# EAGLE design Domino USB MicroSD Passive Overcurrent Protection (EAGLE 6.5.0)
DATABASE: ./../Common/BOM/Domino_DB.txt; DRAWN: M.STEMPIN; REV: A
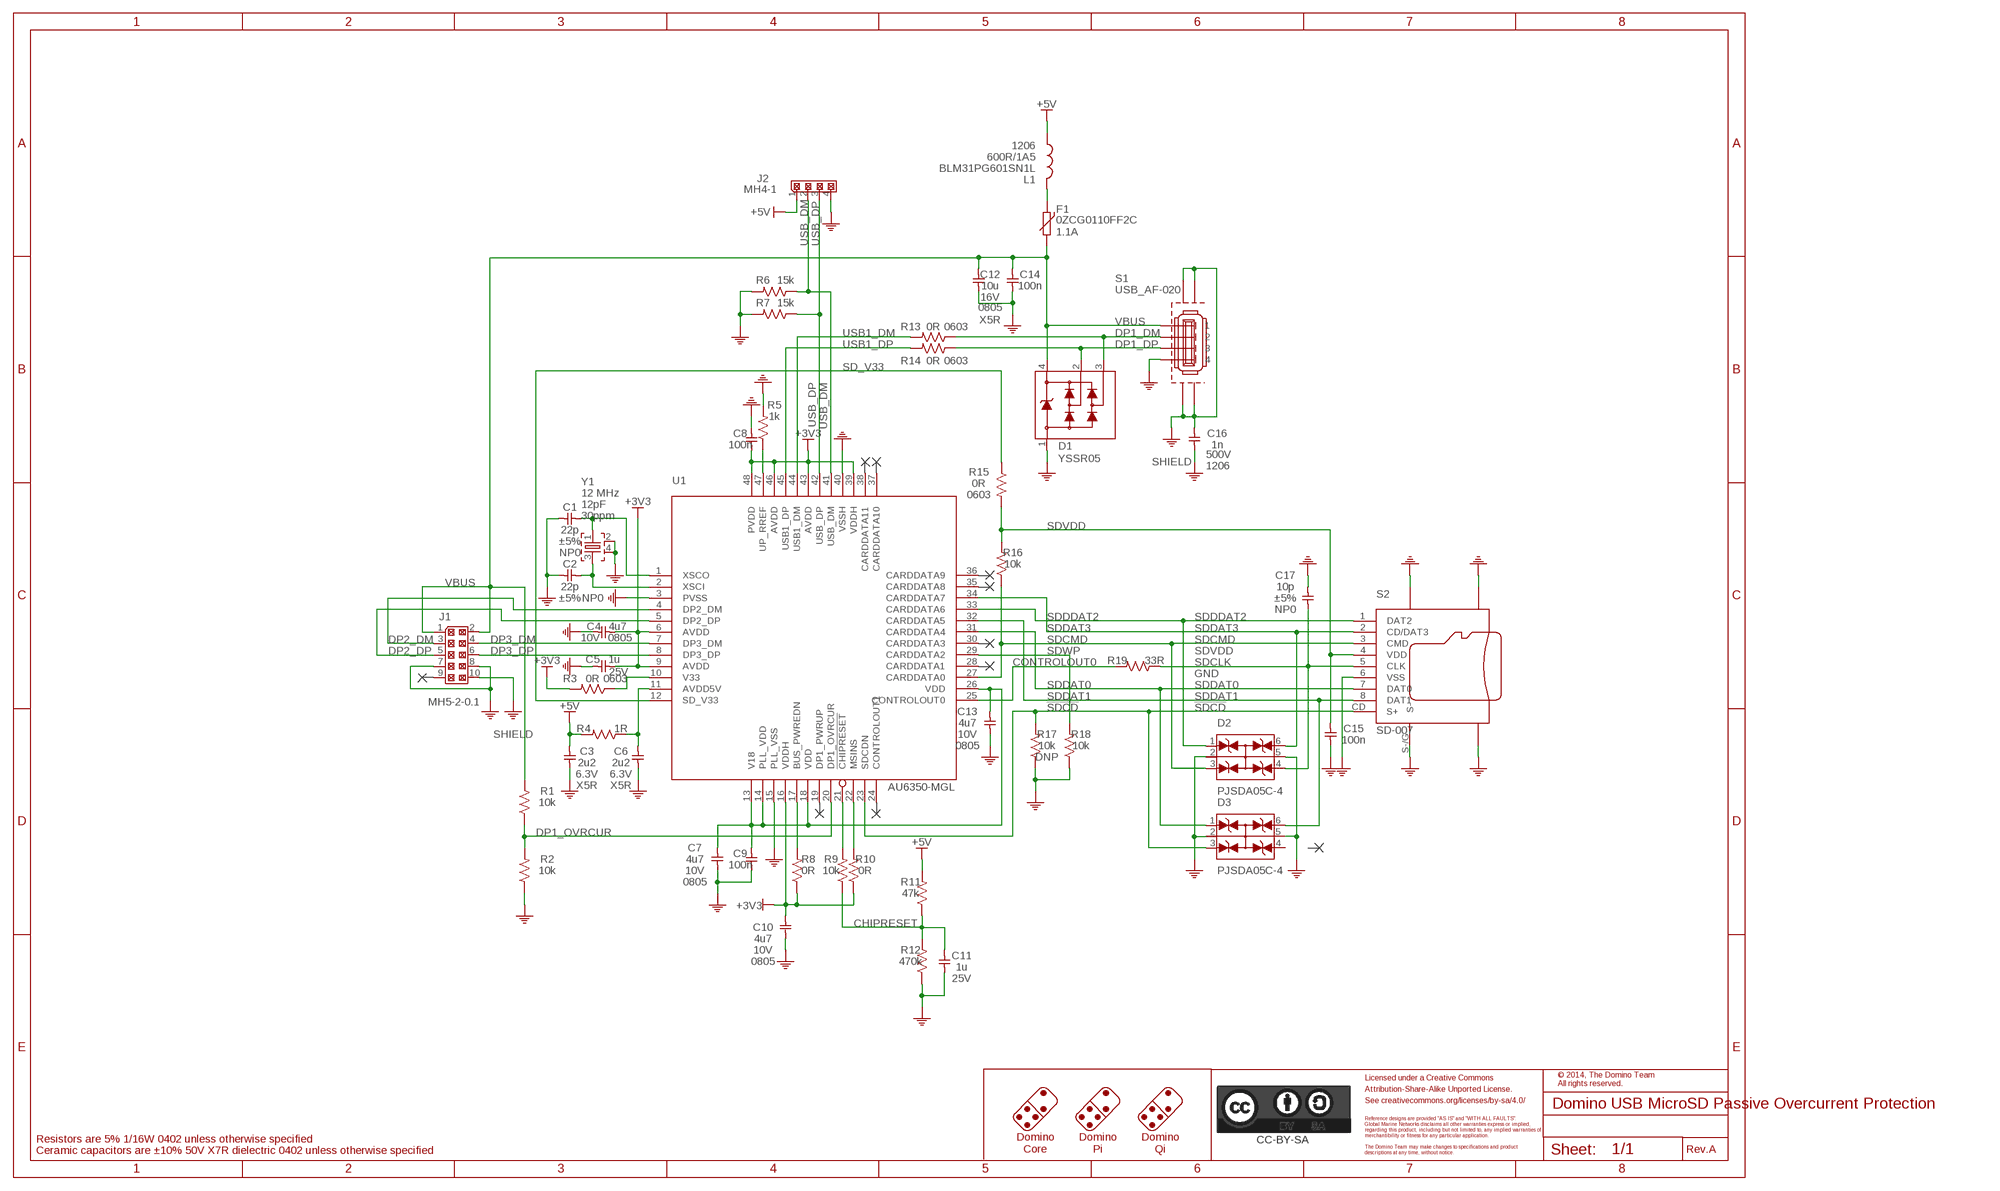
[diagram p0: schematic, sheet 1]
PORT1 (NC): BOM: EXCLUDE
PORT2 (NC): BOM: EXCLUDE
PORT3 (NC): BOM: EXCLUDE
PORT4 (NC): BOM: EXCLUDE
PORT5 (NC): BOM: EXCLUDE
PORT6 (NC): BOM: EXCLUDE
PORT7 (NC): BOM: EXCLUDE
PORT8 (NC): BOM: EXCLUDE
PORT9 (NC): BOM: EXCLUDE
PORT10 (NC): BOM: EXCLUDE

## Parts
C1  22p  CAP_0402  [C0402]
C2  22p  CAP_0402  [C0402]
C3  2u2  CAP_0402  [C0402]
C4  4u7  CAP_0805  [C0805]
C5  1u  CAP_0402  [C0402]
C6  2u2  CAP_0402  [C0402]
C7  4u7  CAP_0805  [C0805]
C8  100n  CAP_0402  [C0402]
C9  100n  CAP_0402  [C0402]
C10  4u7  CAP_0805  [C0805]
C11  1u  CAP_0402  [C0402]
C12  10u  CAP_0805  [C0805]
C13  4u7  CAP_0805  [C0805]
C14  100n  CAP_0402  [C0402]
C15  100n  CAP_0402  [C0402]
C16  1n  CAP_1206  [C1206]
C17  10p  CAP_0402  [C0402]
CC-BY-SA1  CC-BY-SA_LOGO  [CC-BY-SA_LOGO]
D1  YSSR05  [SOT143B]
D2  PJSDA05C-4  [SOT23-6]
D3  PJSDA05C-4  [SOT23-6]
F1  0ZCG0110FF2C  [PTC1812]
J1  MH5-2-0.1  MH5-2  [MH05-2-0.1]
J2  MH4-1  [MH4-1-0.1]
L1  BLM31PG601SN1L  FB_1206  [FB1206]
R1  10k  RES_0402  [R0402]
R2  10k  RES_0402  [R0402]
R3  0R  RES_0603  [R0603]
R4  1R  RES_0402  [R0402]
R5  1k  RES_0402  [R0402]
R6  15k  RES_0402  [R0402]
R7  15k  RES_0402  [R0402]
R8  0R  RES_0402  [R0402]
R9  10k  RES_0402  [R0402]
R10  0R  RES_0402  [R0402]
R11  47k  RES_0402  [R0402]
R12  470k  RES_0402  [R0402]
R13  0R  RES_0603  [R0603]
R14  0R  RES_0603  [R0603]
R15  0R  RES_0603  [R0603]
R16  10k  RES_0402  [R0402]
R17  10k  RES_0402  [R0402]
R18  10k  RES_0402  [R0402]
R19  33R  RES_0402  [R0402]
S1  USB_AF-020  [USB_AF-020]
S2  SD-007  MICRO-SD  [SD-007]
U1  AU6350-MGL  [LQFP-48_7X7]
Y1  12 MHz  CRYSTAL_2SH  [CRYSTAL_32X25]

## Nets
!CHIPRESET: R9.2 U1.21(!CHIPRESET)
!SDCD: D3.3 R17.2 S2.CD(S+) U1.23(SDCDN)
+3V3: C4.2 C5.2 C8.2 C10.2 R3.2 R8.1 R10.1 U1.6(AVDD) U1.9(AVDD) U1.16(VDDH) U1.39(VDDH) U1.43(AVDD) U1.46(AVDD) U1.48(PVDD)
+5V: C3.1 J2.1 L1.2 R4.2 R11.2
BUS_PWREDN: R8.2 U1.17(BUS_PWREDN)
CHIPRESET: C11.1 R9.1 R11.1 R12.2
CONTROLOUT0: R19.2 U1.25(CONTROLOUT0)
DP1_DM: D1.3 R13.1 S1.2
DP1_DP: D1.2 R14.1 S1.3
DP1_OVRCUR: R1.1 R2.2 U1.20(DP1_OVRCUR)
DP2_DM: J1.3 U1.4(DP2_DM)
DP2_DP: J1.5 U1.5(DP2_DP)
DP3_DM: J1.4 U1.7(DP3_DM)
DP3_DP: J1.6 U1.8(DP3_DP)
GND: C1.1 C2.1 C3.2 C4.1 C5.1 C6.2 C7.1 C8.1 C9.2 C10.1 C11.2 C12.2 C13.1 C14.2 C15.2 C16.2 C17.2 D1.1 D2.2 D2.5 D3.2 D3.5 J1.7 J1.8 J2.4 R2.1 R5.2 R6.2 R7.2 R12.1 R17.1 R18.1 S1.4 S2.6(VSS) S2.G$1(G) S2.G$2(G) S2.G$3(G) S2.S-/G(S-) U1.3(PVSS) U1.15(PLL_VSS) U1.40(VSSH) Y1.2 Y1.4
MSINS: R10.2 U1.22(MSINS)
N$2: F1.1 L1.1
N$3: C6.1 R4.1 U1.11(AVDD5V)
N$4: R3.1 U1.10(V33)
SD_V33: R15.1 U1.12(SD_V33)
SDCLK: C17.1 D2.4 R19.1 S2.5(CLK)
SDCMD: D2.3 R16.1 S2.3(CMD) U1.27(CARDDATA0)
SDDAT0: D3.1 S2.7(DAT0) U1.31(CARDDATA4)
SDDAT1: D3.6 S2.8(DAT1) U1.32(CARDDATA5)
SDDAT3: D2.6 S2.2(CD/DAT3) U1.34(CARDDATA7)
SDDDAT2: D2.1 S2.1(DAT2) U1.33(CARDDATA6)
SDVDD: C15.1 R15.2 R16.2 S2.4(VDD)
SDWP: R18.2 U1.29(CARDDATA2)
SHIELD: C16.1 J1.10 S1.G$1(G) S1.G$2(G) S1.G$3(G) S1.G$4(G)
UP_PREF: R5.1 U1.47(UP_RREF)
USB1_DM: R13.2 U1.44(USB1_DM)
USB1_DP: R14.2 U1.45(USB1_DP)
USB_DM: J2.2 R6.1 U1.41(USB_DM)
USB_DP: J2.3 R7.1 U1.42(USB_DP)
V18: C7.2 C9.1 C13.2 U1.13(V18) U1.14(PLL_VDD) U1.18(VDD) U1.26(VDD)
VBUS: C12.1 C14.1 D1.4 F1.2 J1.1 J1.2 R1.2 S1.1
XSCI: C2.2 U1.2(XSCI) Y1.3
XSCO: C1.2 U1.1(XSCO) Y1.1
Unconnected: D3.4 J1.9 U1.19(DP1_PWRUP) U1.24(CONTROLOUT1) U1.28(CARDDATA1) U1.30(CARDDATA3) U1.35(CARDDATA8) U1.36(CARDDATA9) U1.37(CARDDATA10) U1.38(CARDDATA11)

## Notes on the sheet
- Licensed under a Creative Commons
- © 2014, The Domino Team
  All rights reserved.
- Attribution-Share-Alike Unported License.
- See creativecommons.org/licenses/by-sa/4.0/
- Reference designs are provided "AS IS" and "WITH ALL FAULTS".
- Global Marine Networks disclaims all other warranties express or implied,
- regarding this product, including but not limited to, any implied warranties of
- merchantibility or fitness for any particular application.
- Resistors are 5% 1/16W 0402 unless otherwise specified
- Domino
  Core
- Domino
  Pi
- Domino
  Qi
- The Domino Team may make changes to specifications and product
- Ceramic capacitors are ±10% 50V X7R dielectric 0402 unless otherwise specified | descriptions at any time, without notice. | Rev.

## Library data of the parts
C1 C2 = Domino:CAP_: Capacitor; PARTNO: C0402_22p_NP0_5%_CER_50V; SIZE: 0402; TC: NP0; TOL: ±5%; TYPE: CER; VOLT: 50V
C3 C6 = Domino:CAP_: Capacitor; PARTNO: C0402_2u2_X5R_10%_CER_6V3; SIZE: 0402; TC: X5R; TOL: ±10%; TYPE: CER; VOLT: 6.3V
C4 C7 C10 C13 = Domino:CAP_: Capacitor; PARTNO: C0805_4u7_X7R_10%_CER_6V3; SIZE: 0805; TC: X7R; TOL: 10%; TYPE: CER; VOLT: 10V
C5 C11 = Domino:CAP_: Capacitor; PARTNO: C0402_1u_X7R_10%_CER_25V; SIZE: 0402; TC: X7R; TOL: ±10%; TYPE: CER; VOLT: 25V
C8 C9 C14 C15 = Domino:CAP_: Capacitor; PARTNO: C0402_100n_X7R_10%_CER_50V; SIZE: 0402; TC: X7R; TOL: ±10%; TYPE: CER; VOLT: 50V
C12 = Domino:CAP_: Capacitor; PARTNO: C0805_10u_X5R_10%_CER_16V; SIZE: 0805; TC: X5R; TOL: ±10%; TYPE: CER; VOLT: 16V
C16 = Domino:CAP_: Capacitor; PARTNO: C1206_1n_X7R_10%_CER_500V; SIZE: 1206; TC: X7R; TOL: ±10%; TYPE: CER; VOLT: 500V
C17 = Domino:CAP_: Capacitor; PARTNO: C0402_10p_NP0_5%_CER_50V; SIZE: 0402; TC: NP0; TOL: ±5%; TYPE: CER; VOLT: 50V
CC-BY-SA1 = Domino:CC-BY-SA_LOGO: Attribution-Share-Alike Unported License See creativecommons.org/licenses/by-sa/3.0/ for details.; BOM: EXCLUDE
D1 = Domino:YSSR05: Ultra low capacitance double rail-to-rail ESD protection diode; PARTNO: YSSR05
D2 D3 = Domino:PJSDA05C-4: TVS Array Quad for ESD Protection
F1 = Domino:0ZCG: Bel 0ZCG Series Surface Mount PTC; PARTNO: 0ZCG0110FF2C; RATE: 1.1A; VOLT: 8V
J1 = Domino:MH5-2: 2x5 Pin Male Header; PARTNO: MH5-2-0.1
J2 = Domino:MH4-1: 4x1 Pin Male Header; PARTNO: MH4-1-0.1
L1 = Domino:FB_: Ferrite Bead; OPT: 600R/1A5; PARTNO: BLM31PG601SN1L; SIZE: 1206
R1 R2 R9 R16 R18 = Domino:RES_: Resistor; PARTNO: R0402_10k_5%_62.5mW; RATE: 62.5mW; SIZE: 0402; TOL: 5%
R3 R13-R15 = Domino:RES_: Resistor; PARTNO: R0603_0R_5%_125mW; RATE: 125mW; SIZE: 0603; TOL: 5%
R4 = Domino:RES_: Resistor; PARTNO: R0402_1R_5%_62.5mW; RATE: 62.5mW; SIZE: 0402; TOL: 5%
R5 = Domino:RES_: Resistor; PARTNO: R0402_1k_5%_62.5mW; RATE: 62.5mW; SIZE: 0402; TOL: 5%
R6 R7 = Domino:RES_: Resistor; PARTNO: R0402_15k_5%_62.5mW; RATE: 62.5mW; SIZE: 0402; TOL: 5%
R8 R10 = Domino:RES_: Resistor; PARTNO: R0402_0R_5%_62.5mW; RATE: 62.5mW; SIZE: 0402; TOL: 5%
R11 = Domino:RES_: Resistor; PARTNO: R0402_47k_5%_62.5mW; RATE: 62.5mW; SIZE: 0402; TOL: 5%
R12 = Domino:RES_: Resistor; PARTNO: R0402_470k_5%_62.5mW; RATE: 62.5mW; SIZE: 0402; TOL: 5%
R17 = Domino:RES_: Resistor; DNP: T; PARTNO: R0402_10k_5%_62.5mW; RATE: 62.5mW; SIZE: 0402; TOL: 5%
R19 = Domino:RES_: Resistor; PARTNO: R0402_33R_5%_62.5mW; RATE: 62.5mW; SIZE: 0402; TOL: 5%
S1 = Domino:USB_AF-020: USB Type A Socket; PARTNO: USB_AF-020
S2 = Domino:MICRO-SD: Micro SD Memory Card Connector, With Card Detect Switch; PARTNO: SD-007
U1 = Domino:AU6350-MGL: USB2.0 Hub-Reader Controller; PARTNO: AU6350-MGL
Y1 = Domino:CRYSTAL_2SH: Crystal with 2 Shield Pins; LOAD: 12pF; PARTNO: CRYSTAL_32X25_2SH_12PF_30PPM; TOL: 30ppm

## Net classes
1 USB: width 0.254 mm, clearance 0.127 mm
2 PoE: width 0.61 mm, clearance 0.13 mm to class 0, clearance 0.13 mm to class 1, clearance 0.13 mm

## Board
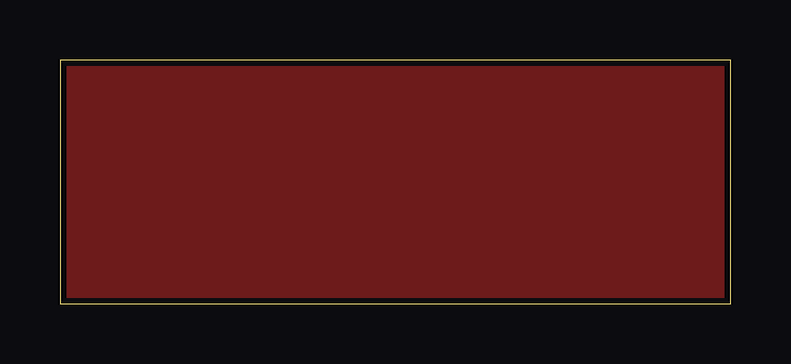
[diagram p1: board, top side]
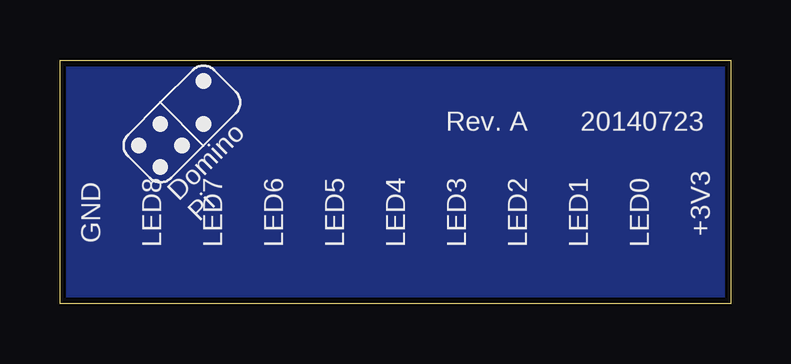
[diagram p2: board, bottom side, seen from below]

Size 27.94 x 10.16 mm. Coordinates in mm from the lower left corner, seen from the top.
Outline: 0,0 27.94,0 27.94,10.16 0,10.16 0,0
Copper layers (1*16): Top 0.043mm / dielectric 1mm / Bottom 0.043mm
Design rules "Domino": minimum track width 0.1mm, minimum drill 0.3mm, track to track 6mil, track to pad 6mil, pad to pad 6mil, via to via 6mil, smd to smd 0mil, copper to edge 0.25mm, drill to drill 0.35mm, minimum pad ring 0.085mm, minimum via ring 0.1mm, stop-mask expansion 0mil, vias tented up to drill 0.45mm, thermal gap 0.2mm

### Footprints (pad centres in the part's own frame; a part is rotated, then mirrored left to right if it is on the bottom)
C0402 = smd 0.508 x 0.508: 1 -0.381,0; 2 0.381,0
C0805 = smd 1.016 x 1.524: 1 -0.889,0; 2 0.889,0
C1206 = smd 1.143 x 1.778: 1 -1.524,0; 2 1.524,0
SOT143B = smd 1.2 x 1.4: 1 -0.76,-1.1 | smd 1 x 1.4: 2 0.96,-1.1; 3 0.96,1.1; 4 -0.96,1.1
SOT23-6 = smd 0.6 x 1.1: 1 -0.95,-1.3; 2 0,-1.3; 3 0.95,-1.3; 4 0.95,1.3; 5 0,1.3; 6 -0.95,1.3
PTC1812 = smd 1.778 x 3.556: 1 -2.54,0; 2 2.54,0
MH05-2-0.1 = drill 1 square: 1 -1.27,5.08 | drill 1: 2 1.27,5.08; 3 -1.27,2.54; 4 1.27,2.54; 5 -1.27,0; 6 1.27,0; 7 -1.27,-2.54; 8 1.27,-2.54; 9 -1.27,-5.08; 10 1.27,-5.08
MH4-1-0.1 = drill 1.016 pad 1.88 square: 1 0,0 | drill 1.016 pad 1.88: 2 2.54,0; 3 5.08,0; 4 7.62,0
FB1206 = smd 1.4 x 1.8: 1 -1.35,0; 2 1.35,0
R0402 = smd 0.508 x 0.508: 1 -0.381,0; 2 0.381,0
R0603 = smd 0.635 x 0.889: 1 -0.635,0; 2 0.635,0
USB_AF-020 = drill 0.8: 1 0,2.6; 2 0,4.6; 3 0,6.6; 4 0,8.6 | drill 1.35: G$1 -2.7,2.1; G$2 2.7,2.1; G$3 2.7,9.1; G$4 -2.7,9.1
SD-007 = smd 0.7 x 1.6: 1 2.25,15; 2 1.15,15; 3 0.05,15; 4 -1.05,15; 5 -2.15,15; 6 -3.25,15; 7 -4.35,15; 8 -5.45,15; CD -6.55,15 | smd 1.6 x 1.5: G$1 6.85,14 | smd 1.2 x 2.2: G$2 7.75,4.4; G$3 -7.75,4.4 | smd 1.2 x 1.5: S-/G -7.75,14 | hole 1: -4.95,4; 3.05,4
LQFP-48_7X7 = smd 1.45 x 0.3: 1 -4.2,2.75; 2 -4.2,2.25; 3 -4.2,1.75; 4 -4.2,1.25; 5 -4.2,0.75; 6 -4.2,0.25; 7 -4.2,-0.25; 8 -4.2,-0.75; 9 -4.2,-1.25; 10 -4.2,-1.75; 11 -4.2,-2.25; 12 -4.2,-2.75; 25 4.2,-2.75; 26 4.2,-2.25; 27 4.2,-1.75; 28 4.2,-1.25; 29 4.2,-0.75; 30 4.2,-0.25; 31 4.2,0.25; 32 4.2,0.75; 33 4.2,1.25; 34 4.2,1.75; 35 4.2,2.25; 36 4.2,2.75 | smd 0.3 x 1.45: 13 -2.75,-4.2; 14 -2.25,-4.2; 15 -1.75,-4.2; 16 -1.25,-4.2; 17 -0.75,-4.2; 18 -0.25,-4.2; 19 0.25,-4.2; 20 0.75,-4.2; 21 1.25,-4.2; 22 1.75,-4.2; 23 2.25,-4.2; 24 2.75,-4.2; 37 2.75,4.2; 38 2.25,4.2; 39 1.75,4.2; 40 1.25,4.2; 41 0.75,4.2; 42 0.25,4.2; 43 -0.25,4.2; 44 -0.75,4.2; 45 -1.25,4.2; 46 -1.75,4.2; 47 -2.25,4.2; 48 -2.75,4.2
CRYSTAL_32X25 = smd 1.27 x 1.397: 1 -0.889,1.143; 2 -0.889,-1.143; 3 0.889,-1.143; 4 0.889,1.143

### Placement (x,y rotation side)
C1  -113.03,-190.5 0 top  (outside the outline)
C2  -113.03,-170.18 0 top  (outside the outline)
C3  -132.08,-341.63 0 top  (outside the outline)
C4  -119.38,-335.28 0 top  (outside the outline)
C5  -113.03,-330.2 0 top  (outside the outline)
C6  -113.03,-271.78 0 top  (outside the outline)
C7  -113.03,-335.28 0 top  (outside the outline)
C8  -113.03,-175.26 0 top  (outside the outline)
C9  -113.03,-205.74 0 top  (outside the outline)
C10  -125.73,-335.28 0 top  (outside the outline)
C11  -113.03,-297.18 0 top  (outside the outline)
C12  -113.03,-115.57 0 top  (outside the outline)
C13  -132.08,-335.28 0 top  (outside the outline)
C14  -113.03,-121.92 0 top  (outside the outline)
C15  -113.03,-256.54 0 top  (outside the outline)
C16  -111.76,-128.27 0 top  (outside the outline)
C17  -132.08,-356.87 0 top  (outside the outline)
CC-BY-SA1  -5.08,-50.8 0 top  (outside the outline)
D1  -113.03,-58.42 0 top  (outside the outline)
D2  -130.81,-363.22 0 top  (outside the outline)
D3  -130.81,-369.57 0 top  (outside the outline)
DRILEGEND  [DRILEGEND]  81.53,61.21 0 top  (outside the outline)
F1  -110.49,-109.22 0 top  (outside the outline)
J1  -90.17,-54.61 0 top  (outside the outline)
J2  -113.03,-323.85 0 top  (outside the outline)
L1  -111.76,-101.6 0 top  (outside the outline)
R1  -113.03,-266.7 0 top  (outside the outline)
R2  -113.03,-261.62 0 top  (outside the outline)
R3  -132.08,-351.79 0 top  (outside the outline)
R4  -132.08,-346.71 0 top  (outside the outline)
R5  -113.03,-185.42 0 top  (outside the outline)
R6  -113.03,-307.34 0 top  (outside the outline)
R7  -113.03,-302.26 0 top  (outside the outline)
R8  -113.03,-215.9 0 top  (outside the outline)
R9  -113.03,-292.1 0 top  (outside the outline)
R10  -113.03,-276.86 0 top  (outside the outline)
R11  -113.03,-281.94 0 top  (outside the outline)
R12  -113.03,-287.02 0 top  (outside the outline)
R13  -113.03,-246.38 0 top  (outside the outline)
R14  -113.03,-251.46 0 top  (outside the outline)
R15  -113.03,-241.3 0 top  (outside the outline)
R16  -113.03,-236.22 0 top  (outside the outline)
R17  -113.03,-226.06 0 top  (outside the outline)
R18  -113.03,-231.14 0 top  (outside the outline)
R19  -113.03,-317.5 0 top  (outside the outline)
S1  -97.79,-49.53 0 top  (outside the outline)
S2  -76.2,-54.61 0 top  (outside the outline)
U1  -62.23,-55.88 0 top  (outside the outline)
U$3  [A5L-LOC]  -55.88,-62.23 0 top  (outside the outline)
U$4  [DOMINO_LOGO_SMALL]  22.86,7.49 0 bottom
Y1  -106.68,-58.42 0 top  (outside the outline)

### Tracks (layer width: path | path; a pad name or v marks a point on that pad's centre or on a via)
!CHIPRESET  (1 unrouted)
!SDCD  (3 unrouted)
+3V3  (13 unrouted)
+5V  (4 unrouted)
BUS_PWREDN  (1 unrouted)
CHIPRESET  (3 unrouted)
CONTROLOUT0  (1 unrouted)
DP1_DM  (2 unrouted)
DP1_DP  (2 unrouted)
DP1_OVRCUR  (2 unrouted)
DP2_DM  (1 unrouted)
DP2_DP  (1 unrouted)
DP3_DM  (1 unrouted)
DP3_DP  (1 unrouted)
GND  (42 unrouted)
  pour Top: 0,10.16 27.94,10.16 27.94,0 0,0
  pour Bottom: 0,10.16 27.94,10.16 27.94,0 0,0
MSINS  (1 unrouted)
N$2  (1 unrouted)
N$3  (2 unrouted)
N$4  (1 unrouted)
SD_V33  (1 unrouted)
SDCLK  (3 unrouted)
SDCMD  (3 unrouted)
SDDAT0  (2 unrouted)
SDDAT1  (2 unrouted)
SDDAT3  (2 unrouted)
SDDDAT2  (2 unrouted)
SDVDD  (3 unrouted)
SDWP  (1 unrouted)
SHIELD  (5 unrouted)
UP_PREF  (1 unrouted)
USB1_DM  (1 unrouted)
USB1_DP  (1 unrouted)
USB_DM  (2 unrouted)
USB_DP  (2 unrouted)
V18  (6 unrouted)
VBUS  (7 unrouted)
XSCI  (2 unrouted)
XSCO  (2 unrouted)

### Text on the board
bPlace: +3V3 | LED0 | LED1 | LED2 | LED3 | LED4 | LED5 | LED6 | LED7 | LED8 | GND
bNames: Rev. A
Document: DRILL CHART: TOP TO BOTTOM | STACK-UP FOR REFERENCE | LAYER 1 L1 TOP | 18 UM CU + 12.5 UM PLATING (30.5 UM) | 1.061 MM+/-10% | CORE | 1.0 MM CORE FR-4 LG 135 / INCLUDING COPPER | LAYER 4 L16 BOTTOM | 18 UM CU + 12.5 UM PLATING (30.5 UM) | NOTES: | 1. PRINTED CIRCUIT BOARD MADE FROM NEMA GRADE FR-4 TG 135 EPOXY / LAMINATE WITH 18 UM COPPER PLATING AND 1 MM THICKNESS. | 2. ALL DIMENSIONS ARE GIVEN IN MILLIMETERS EXCEPT TRACE WIDTH/SPACE. | 3. CIRCUIT PATHS ARE FOR REFERENCE ONLY. | 4. HOLE SIZES SHOWN ARE FINISHED DIAMETERS AFTER PLATING. | 5. BOARD PLATED USING REFLOW OR SIMILAR METHOD. | 6. BOARD TO HAVE WHITE SOLDER MASK ON PLATED SURFACES USING WET / FILM SR100 OR SR1010 EPOXY. / EQUIVALENT WET OR DRY FILM MAY BE USED. | 7. SILKSCREEN BOARD USING BLACK INK. DISTORTION OF SILKSCREEN / IS ACCEPTABLE OVER TRACES. EPOXY INK ON PLATED LANDS IS NOT / ACCEPTABLE | 8. THE FOLLOWING INFORMATION APPLIES TO THIS BOARD: | * 2 COPPER LAYERS | * 1 MM BOARD THICKNESS | * REQUIRES TOP AND BOTTOM SIDE SILKSCREENS | © 2014, The Domino Team / All rights reserved. | Licensed under a Creative Commons / Attribution-Share-Alike Unported License. / See creativecommons.org/licenses/by-sa/4.0/ | Reference designs are provided "AS IS" and "WITH ALL FAULTS". / The Domino Team disclaims all other warranties express or implied, / regarding this product, including but not limited to, any implied warranties of / merchantibility or fitness for any particular application. | Domino / Core | Domino / Pi | Domino / Qi | The Domino Team may make changes to specifications and product descriptions / at any time, without notice. | Rev.
DrillLegend: LAYER-STACK
DrillLegend_01-16: 01-16
Pinout: +3V3 | LED0 | LED1 | ELD2 | ELD3 | LED4 | LED5 | LED6 | LED7 | LED8 | GND | Pinout (.PIN)
Component_side: Component Side (.CMP)
Solder_side: Solder side (.SOL)
Silk_screen_CMP: Silk screen CMP (.PLC)
Silk_screen_SOL: Silk screen SOL (.PLS)
Solder_stop_mask_CMP: Solder stop mask CMP (.STC)
Solder_stop_mask_SOL: Solder stop mask SOL (.STS)
Cream_frame_CMP: Cream frame CMP (.CRC)
Cream_frame_SOL: Cream frame SOL (.CRS)
Drill_data: Drill data (.DRD)
Component_Assembly_CMP: Component Assembly CMP (.ASC)
Component_Assembly_SOL: Component Assembly SOL (.ASS)
Outline: Outline (.OLN)